# Altium schematic sheet PowerSupply.SchDoc
size A4; SheetNumber: 1; SheetTotal: 5
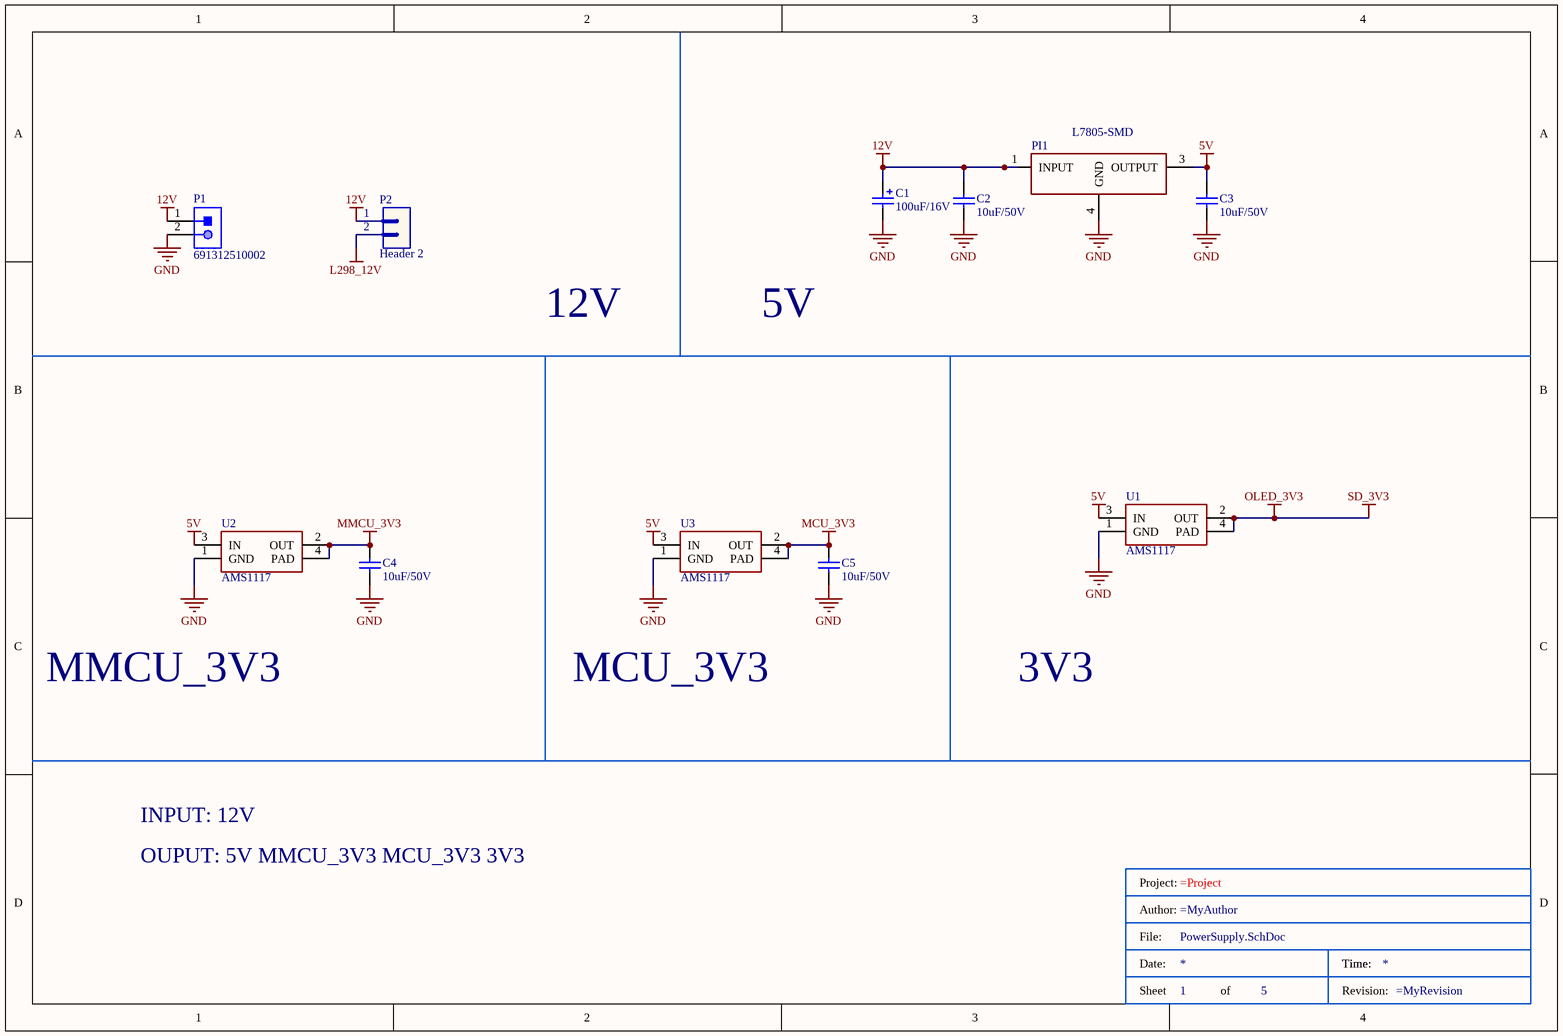
[diagram p0: PowerSupply.SchDoc]

## Parts
*  Title Block  (value not drawn)  (graphical)
C1  value 100uF/16V  [CAP-SM-AL-SIZE-D-D6L6]  (hidden comment: Cap-Al-100uF-16V-D6L5)
C2  value 10uF/50V  [CAP-SM-0805]  (hidden comment: Cap-10uF-50V-0805)
C3  value 10uF/50V  [CAP-SM-0805]  (hidden comment: Cap-10uF-50V-0805)
C4  value 10uF/50V  [CAP-SM-0805]  (hidden comment: Cap-10uF-50V-0805)
C5  value 10uF/50V  [CAP-SM-0805]  (hidden comment: Cap-10uF-50V-0805)
P1  691312510002  [691312510002]
P2  Header 2  [JP2]
PI1  L7805-SMD  [TO254P1435X464-4N]
U1  AMS1117  [SOT223]
U2  AMS1117  [SOT223]
U3  AMS1117  [SOT223]

## Nets
5V: C3.2 PI1.3(OUTPUT) U1.3(IN) U2.3(IN) U3.3(IN)
12V: C1.1 C2.2 P1.1 P2.1 PI1.1(INPUT)
GND: C1.2 C2.1 C3.1 C4.2 C5.2 P1.2 PI1.4(GND) U1.1(GND) U2.1(GND) U3.1(GND)
L298_12V: P2.2
MCU_3V3: C5.1 U3.2(OUT) U3.4(PAD)
MMCU_3V3: C4.1 U2.2(OUT) U2.4(PAD)
OLED_3V3: U1.2(OUT) U1.4(PAD)  [also labelled SD_3V3]

## Notes on the sheet
- 12V
- 5V
- MMCU_3V3
- MCU_3V3
- 3V3
- INPUT: 12V
- OUPUT: 5V MMCU_3V3 MCU_3V3 3V3
- (in symbol Title Block) Project:; Author:; File:; Date:; Time:; Sheet; of; Revision:

## Library data of the parts
C1 = Cap-Al-100uF-16V-D6L5: CAP ALUM 100UF 20% 16V SMD; Manufacturer: Nichicon; Manufacturer Part Number: UWX1C101MCL1GB; Local Supplier: thegioiic; Local Supplier Link: https://www.thegioiic.com/products/tu-nhom-smd-100uf-16v-6-3x5-4mm; Supplier 1: Digikey; Supplier 1 Part Number: 493-2105-1-ND; Supplier 1 Link: https://www.digikey.com/product-detail/en/nichicon/UWX1C101MCL1GB/493-2105-1-ND/590080
C2-C5 = Cap-10uF-50V-0805: CAP CER 10UF 50V X5R 0805; Manufacturer: Yageo; Manufacturer Part Number: CC0805KKX5R9BB106; Local Supplier: thegioiic; Local Supplier Link: https://www.thegioiic.com/products/tu-gom-0805-10uf-50v; Supplier 1: Digikey; Supplier 1 Link: https://www.digikey.com/product-detail/en/yageo/CC0805KKX5R9BB106/311-3499-2-ND/7164383; Supplier 1 Part Number: 311-3499-2-ND
P1 = 691312510002: WR-TBL Serie 312 Open Horizontal PCB Header, Pluggable, pitch 5.08mm, 2p; Compliance: RoHS; Modularity: No; Pin Number: 2; Rated Current [UL]: 20A; Working Voltage [UL]: 300VAC; ComponentLink1Description: Manufacturer; ComponentLink1URL: http://www.we-online.de; ComponentLink2URL: https://katalog.we-online.de/em/datasheet/691312510002.pdf; ComponentLink2Description: Datasheet; Mounting Technology: THT; Part Number: 691312510002; Packaging: Box; Operating Temperature: -40 to +105degC; PCB/Cable/Panel: PCB; Pitch: 5.08mm; Published Date: October 2019; Type: Horizontal; Publisher: Wurth Elektronik; Application: Pluggable
P2 = Header 2: Header, 2-Pin; LatestRevisionDate: 17-Jul-2002; LatestRevisionNote: Re-released for DXP Platform.; Publisher: Altium Limited; Local Supplier: thegioiic; Local Supplier Part Number: x; Local Supplier Link: https://www.thegioiic.com/products/hang-rao-duc-don-2-54mm-40-chan-1-hang-cao-11-4mm-xuyen-lo
U1-U3 = AMS1117: Available in 1.8V, 2.5V, 2.85V, 3.3V, 5V, and  Adjustable Versions; Local Supplier: thegioiic; Local Supplier Part Number: *; Local Supplier Link: https://www.thegioiic.com/products/ams1117-3-3v
PI1 = L7805-SMD: Local Supplier: thegioiic; Local Supplier Part Number: *; Local Supplier Link: https://www.thegioiic.com/products/l7805acd2t